# EAGLE design arduiniq_ver3 (EAGLE 7.2.0)
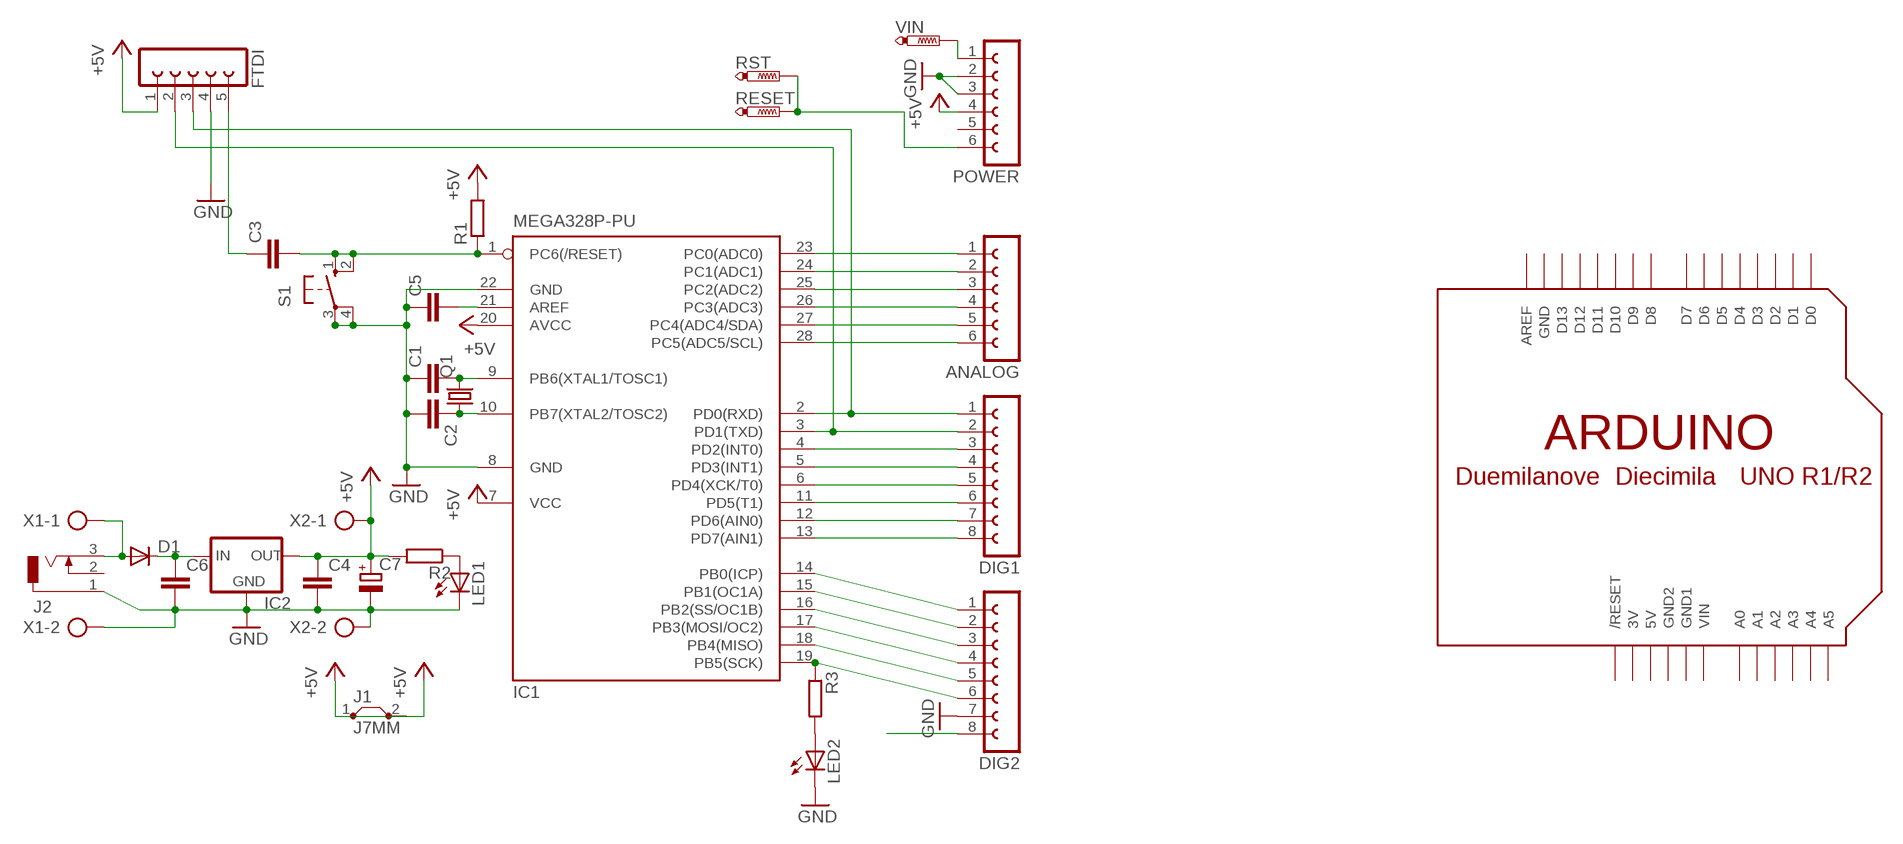
[diagram p0: schematic, sheet 1]

## Parts
ANALOG  FE06-1  [FE06]
C1  C-EU025-024X044  [C025-024X044]
C2  C-EU025-024X044  [C025-024X044]
C3  C-EU025-024X044  [C025-024X044]
C4  C-EU025-024X044  [C025-024X044]
C5  C-EU025-024X044  [C025-024X044]
C6  C-EU025-024X044  [C025-024X044]
C7  CPOL-EUE2.5-6  [E2,5-6]
D1  1N4004  [DO41-10]
DIG1  FE08-1  [FE08]
DIG2  FE08-1  [FE08]
FTDI  FE05-1  [FE05-1]
IC1  MEGA328P-PU  MEGA8-P  [DIL28-3]
IC2  78XXL  [78XXL]
J1  J7MM  [07]
J2  DCJ0303  [DCJ0303]
LED1  LED5MM  [LED5MM]
LED2  LED5MM  [LED5MM]
POWER  FE06-1  [FE06]
Q1  CRYSTALHC49S  [HC49/S]
R1  R-EU_0204/7  [0204/7]
R2  R-EU_0204/7  [0204/7]
R3  R-EU_0207/10  [0207/10]
RESET  PTR1PAD1-13Y  [P1-13Y]
RST  PTR1PAD1-13Y  [P1-13Y]
S1  10-XX  [B3F-10XX]
U$1  ARDUINO-BPLACE  [ARDUINO-BPLACE]
VIN  PTR1PAD1-13Y  [P1-13Y]
X1  AK500/2  [AK500/2]
X2  AK500/2  [AK500/2]

## Nets
+5V: C4.1 C7.+ FTDI.1 IC1.7(VCC) IC1.20(AVCC) IC2.OUT J1.1 J1.2 POWER.4 R1.2 R2.2 X2.1
AREF: C5.2 DIG2.8 IC1.21(AREF)
GND: C1.1 C2.2 C4.2 C5.1 C6.2 C7.- DIG2.7 FTDI.4 IC1.8(GND) IC1.22(GND) IC2.GND J2.1 LED1.K(C) LED2.K(C) POWER.2 POWER.3 S1.3(P) S1.4(P1) X1.2 X2.2
N$1: ANALOG.1 IC1.23(PC0(ADC0))
N$3: POWER.1 VIN.TP
N$4: ANALOG.3 IC1.25(PC2(ADC2))
N$5: ANALOG.2 IC1.24(PC1(ADC1))
N$6: ANALOG.5 IC1.27(PC4(ADC4/SDA))
N$8: ANALOG.6 IC1.28(PC5(ADC5/SCL))
N$9: ANALOG.4 IC1.26(PC3(ADC3))
N$10: C1.2 IC1.9(PB6(XTAL1/TOSC1)) Q1.2
N$11: C3.1 FTDI.5
N$12: DIG1.6 IC1.11(PD5(T1))
N$13: D1.A J2.3 X1.1
N$16: DIG2.2 IC1.15(PB1(OC1A))
N$17: DIG1.1 FTDI.3 IC1.2(PD0(RXD))
N$21: DIG1.2 FTDI.2 IC1.3(PD1(TXD))
N$22: DIG1.3 IC1.4(PD2(INT0))
N$23: DIG1.4 IC1.5(PD3(INT1))
N$24: DIG1.5 IC1.6(PD4(XCK/T0))
N$26: LED2.A R3.2
N$27: C6.1 D1.C IC2.IN
N$28: C2.1 IC1.10(PB7(XTAL2/TOSC2)) Q1.1
N$30: DIG1.7 IC1.12(PD6(AIN0))
N$31: DIG1.8 IC1.13(PD7(AIN1))
N$33: DIG2.1 IC1.14(PB0(ICP))
N$34: DIG2.3 IC1.16(PB2(SS/OC1B))
N$35: DIG2.4 IC1.17(PB3(MOSI/OC2))
N$36: DIG2.5 IC1.18(PB4(MISO))
N$37: DIG2.6 IC1.19(PB5(SCK)) R3.1
N$38: LED1.A R2.1
RESET: C3.2 IC1.1(PC6(/RESET)) POWER.6 R1.1 RESET.TP RST.TP S1.1(S) S1.2(S1)
Unconnected: J2.2 POWER.5 U$1.A0 U$1.A1 U$1.A2 U$1.A3 U$1.A4 U$1.A5 U$1.AREF U$1.D0 U$1.D1 U$1.D2 U$1.D3 U$1.D4 U$1.D5 U$1.D6 U$1.D7 U$1.D8 U$1.D9 U$1.D10 U$1.D11 U$1.D12 U$1.D13 U$1.RESET(/RESET)

## Power pins joined to a net without a drawn wire
3V: U$1.3V
+5V: U$1.5V
GND: U$1.GND
GND1: U$1.GND1
GND2: U$1.GND2
VIN: U$1.VIN

## Library data of the parts
ANALOG POWER = con-lsta:FE06-1: FEMALE HEADER; OC_FARNELL: unknown; OC_NEWARK: unknown
C1-C6 = rcl:C-EU: CAPACITOR, European symbol
C7 = rcl:CPOL-EU: POLARIZED CAPACITOR, European symbol
D1 = diode:1N4004: DIODE general purpose rectifier, 1 A
DIG1 DIG2 = con-lsta:FE08-1: FEMALE HEADER; OC_FARNELL: unknown; OC_NEWARK: unknown
FTDI = con-lsta:FE05-1: FEMALE HEADER; OC_FARNELL: unknown; OC_NEWARK: unknown
IC1 = atmel:MEGA8-P: MICROCONTROLLER 8 Kbytes FLASH, 1 kbytes SRAM, 512 bytes EEPROM, USART, 4-channel 10 bit ADC, 2-channel 8 bit ADC Pin compatible with Atmega48, ATMega88, ATMega168 Source: avr.lbr; OC_FARNELL: unknown; OC_NEWARK: unknown
IC2 = v-reg:78XXL: VOLTAGE REGULATOR
J1 = jumper:J: Bridge
J2 = con-jack:DCJ0303: DC POWER JACK Source: DCJ0303.pdf; OC_FARNELL: unknown; OC_NEWARK: unknown
LED1 LED2 = led:LED: LED OSRAM: - CHIPLED LG R971, LG N971, LY N971, LG Q971, LY Q971, LO R971, LY R971 LH N974, LH R974 LS Q976, LO Q976, LY Q976 LO Q996 - Hyper CHIPLED LW Q18S LB Q993, LB Q99A, LB R99A - SideLED LS A670, LO A670, LY A670, LG A670, LP A670 LB A673, LV A673, LT A673, LW A673 LH A674 LY A675 LS A676, LA A676, LO A676, LY A676, LW A676 LS A679, LY A679, LG A679 - Hyper Micro SIDELED® LS Y876, LA Y876, LO Y876, LY Y876 LT Y87S - SmartLED LW L88C, LW L88S LB L89C, LB L89S, LG L890 LS L89K, LO L89K, LY L89K LS L896, LA L896, LO L896, LY L896 - TOPLED LS T670, LO T670, LY T670, LG T670, LP T670 LSG T670, LSP T670, LSY T670, LOP T670, LYG T670 LG T671, LOG T671, LSG T671 LB T673, LV T673, LT T673, LW T673 LH T674 LS T676, LA T676, LO T676, LY T676, LB T676, LH T676, LSB T676, LW T676 LB T67C, LV T67C, LT T67C, LS T67K, LO T67K, LY T67K, LW E67C LS E67B, LA E67B, LO E67B, LY E67B, LB E67C, LV E67C, LT E67C LW T67C LS T679, LY T679, LG T679 LS T770, LO T770, LY T770, LG T770, LP T770 LB T773, LV T773, LT T773, LW T773 LH T774 LS E675, LA E675, LY E675, LS T675 LS T776, LA T776, LO T776, LY T776, LB T776 LHGB T686 LT T68C, LB T68C - Hyper Mini TOPLED® LB M676 - Mini TOPLED Santana® LG M470 LS M47K, LO M47K, LY M47K Source: http://www.osram.convergy.de LUXEON: - LUMILED® LXK2-PW12-R00, LXK2-PW12-S00, LXK2-PW14-U00, LXK2-PW14-V00 LXK2-PM12-R00, LXK2-PM12-S00, LXK2-PM14-U00 LXK2-PE12-Q00, LXK2-PE12-R00, LXK2-PE12-S00, LXK2-PE14-T00, LXK2-PE14-U00 LXK2-PB12-K00, LXK2-PB12-L00, LXK2-PB12-M00, LXK2-PB14-N00, LXK2-PB14-P00, LXK2-PB14-Q00 LXK2-PR12-L00, LXK2-PR12-M00, LXK2-PR14-Q00, LXK2-PR14-R00 LXK2-PD12-Q00, LXK2-PD12-R00, LXK2-PD12-S00 LXK2-PH12-R00, LXK2-PH12-S00 LXK2-PL12-P00, LXK2-PL12-Q00, LXK2-PL12-R00 Source: www.luxeon.com KINGBRIGHT: KA-3528ASYC Source: www.kingbright.com
Q1 = crystal:CRYSTAL: CRYSTAL; OC_FARNELL: 1667008; OC_NEWARK: unknown
R1-R3 = rcl:R-EU_: RESISTOR, European symbol
RESET RST VIN = testpad:PTR1: TEST PIN
S1 = switch-omron:10-XX: OMRON SWITCH; MPN: B3F-1000; OC_FARNELL: 176432; OC_NEWARK: 36M3542
U$1 = adafruit:ARDUINO: Arduino Diecimila/Duemilanove Make a shield with ease, this package has all the named pins as well as the two mounting drill holes and an outline of the USB and DC power connector. The outline is on the DIMENSION layer, so if your board house uses it they will cut the outline to match. http://www.ladyada.net/library/pcb/eaglelibrary.html
X1 X2 = con-ptr500:AK500/2: CONNECTOR; OC_FARNELL: unknown; OC_NEWARK: unknown

## Board
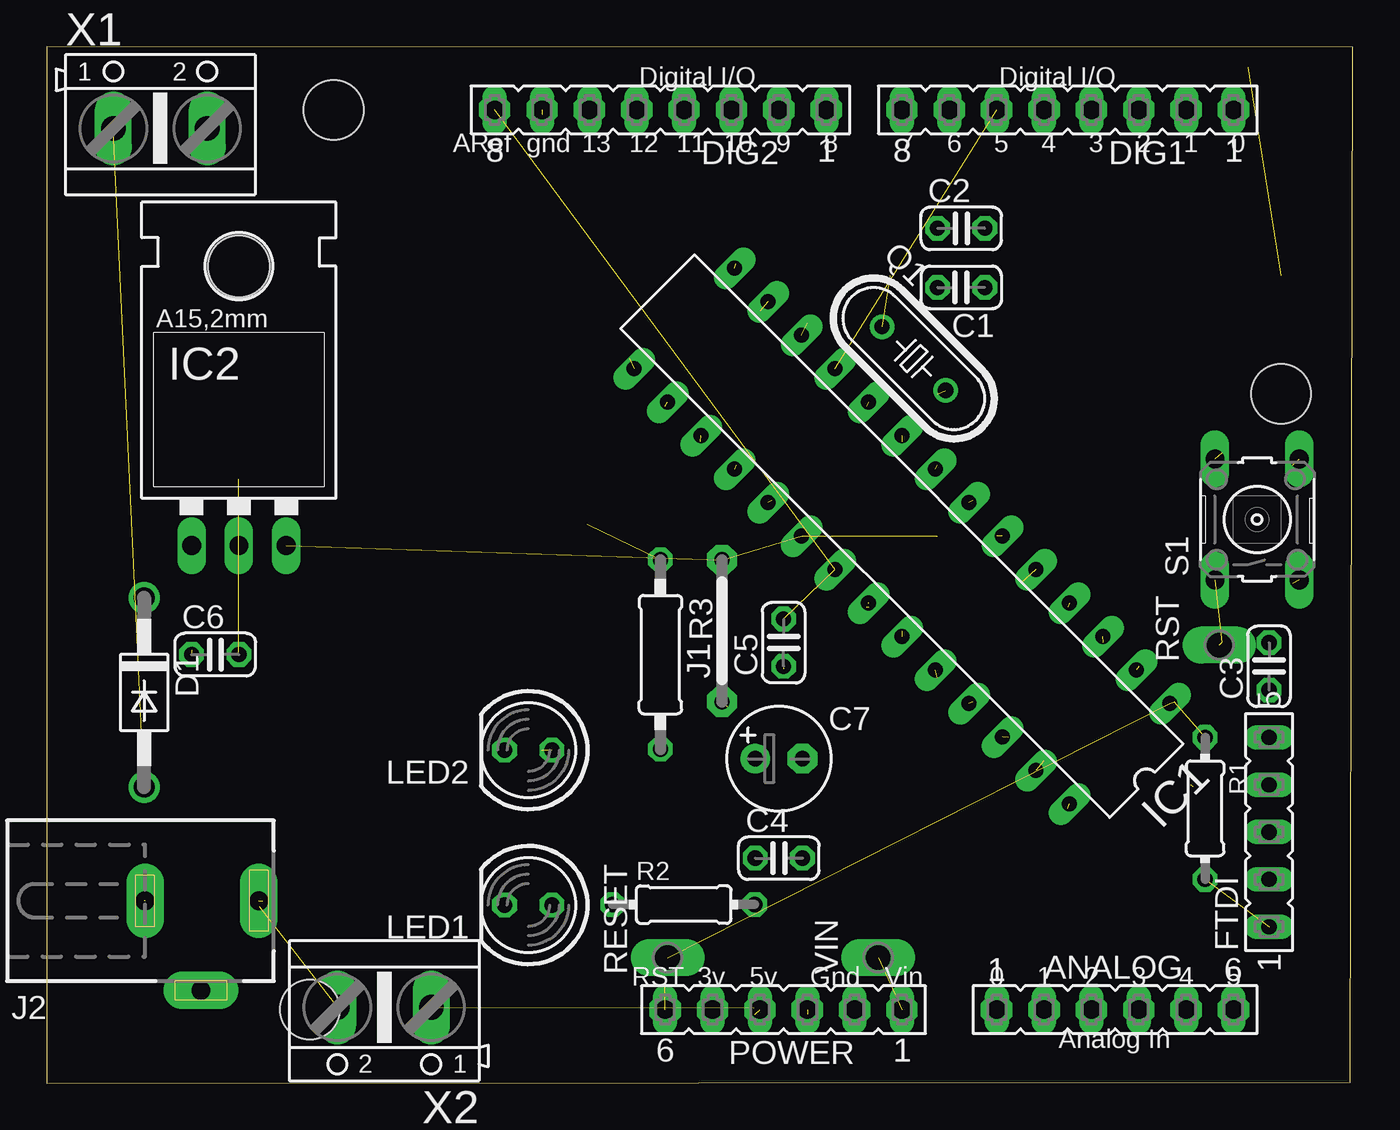
[diagram p1: board, top side]
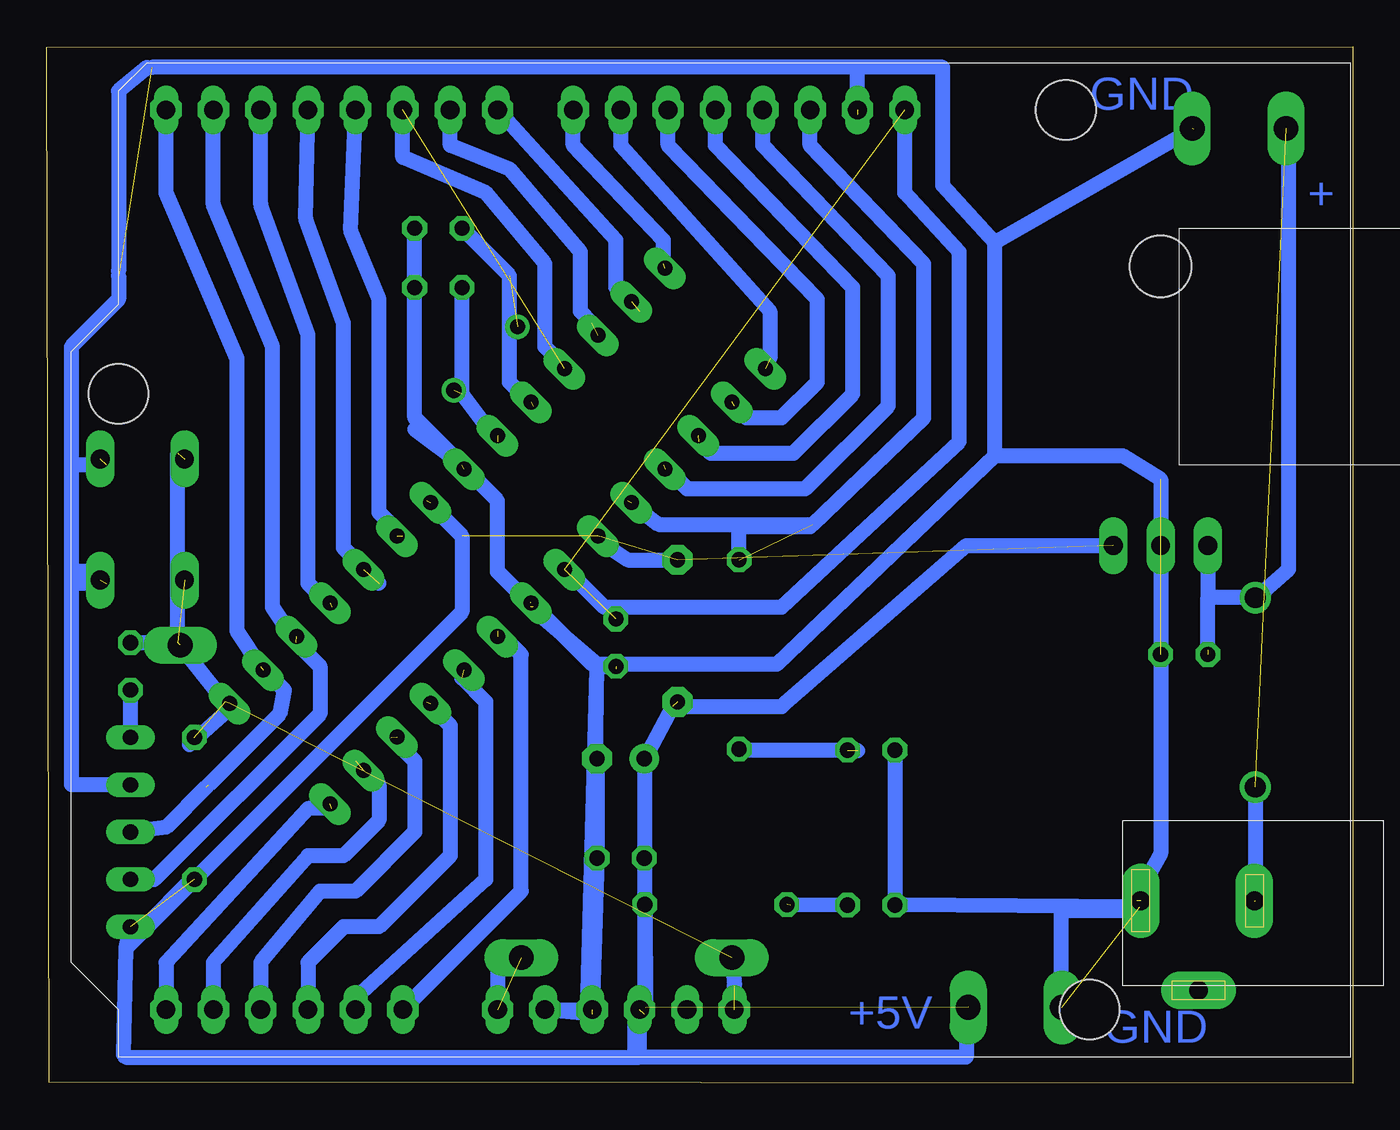
[diagram p2: board, bottom side, seen from below]

Size 70.05 x 55.59 mm. Coordinates in mm from the lower left corner, seen from the top.
Outline: 0,0 69.9,0.05 70.05,55.56 0,55.59 0,0
Copper layers (1*16): Top 0.035mm / dielectric 1.5mm / Bottom 0.035mm
Design rules "default": minimum track width 10mil, minimum drill 24mil, track to track 8mil, track to pad 8mil, pad to pad 8mil, via to via 8mil, smd to smd 8mil, copper to edge 40mil, drill to drill 8mil, minimum pad ring 10mil, minimum via ring 8mil, stop-mask expansion 4mil, vias tented up to drill 0mil, thermal gap 10mil

### Footprints (pad centres in the part's own frame; a part is rotated, then mirrored left to right if it is on the bottom)
FE06 = drill 0.813 long: 1 -6.35,0; 2 -3.81,0; 3 -1.27,0; 4 1.27,0; 5 3.81,0; 6 6.35,0
C025-024X044 = drill 0.813 octagon: 1 -1.27,0; 2 1.27,0
E2,5-6 = drill 0.813 pad 1.6: + -1.27,0 | drill 0.813 pad 1.6 octagon: - 1.27,0
DO41-10 = drill 1.118: A 5.08,0; C -5.08,0
FE08 = drill 0.813 long: 1 -8.89,0; 2 -6.35,0; 3 -3.81,0; 4 -1.27,0; 5 1.27,0; 6 3.81,0; 7 6.35,0; 8 8.89,0
FE05-1 = drill 0.813 long: 1 -5.08,0; 2 -2.54,0; 3 0,0; 4 2.54,0; 5 5.08,0
DIL28-3 = drill 0.813 long: 1 -16.51,-3.81; 2 -13.97,-3.81; 3 -11.43,-3.81; 4 -8.89,-3.81; 5 -6.35,-3.81; 6 -3.81,-3.81; 7 -1.27,-3.81; 8 1.27,-3.81; 9 3.81,-3.81; 10 6.35,-3.81; 11 8.89,-3.81; 12 11.43,-3.81; 13 13.97,-3.81; 14 16.51,-3.81; 15 16.51,3.81; 16 13.97,3.81; 17 11.43,3.81; 18 8.89,3.81; 19 6.35,3.81; 20 3.81,3.81; 21 1.27,3.81; 22 -1.27,3.81; 23 -3.81,3.81; 24 -6.35,3.81; 25 -8.89,3.81; 26 -11.43,3.81; 27 -13.97,3.81; 28 -16.51,3.81
78XXL = drill 1.016 long: GND 0,-3.81; IN -2.54,-3.81; OUT 2.54,-3.81 | hole 3.302: 0,11.176
07 = drill 0.813 pad 1.6 octagon: 1 -3.81,0; 2 3.81,0
DCJ0303 = drill 1 pad 2 long: 1 0,3.1; 2 4.8,0; 3 0,-3
LED5MM = drill 0.813 octagon: A -1.27,0; K 1.27,0
HC49/S = drill 0.813: 1 -2.413,0; 2 2.413,0
0204/7 = drill 0.813 octagon: 1 -3.81,0; 2 3.81,0
0207/10 = drill 0.813 octagon: 1 -5.08,0; 2 5.08,0
P1-13Y = drill 1.321 pad 1.905 long: TP 0,0
B3F-10XX = drill 1.016 long: 1 -3.251,2.261; 2 3.251,2.261; 3 -3.251,-2.261; 4 3.251,-2.261
ARDUINO-BPLACE = drill 1 pad 1.676 octagon: 3V 35.56,2.54; 5V 38.1,2.54; A0 50.8,2.54; A1 53.34,2.54; A2 55.88,2.54; A3 58.42,2.54; A4 60.96,2.54; A5 63.5,2.54; AREF 23.876,50.8; D0 63.5,50.8; D1 60.96,50.8; D2 58.42,50.8; D3 55.88,50.8; D4 53.34,50.8; D5 50.8,50.8; D6 48.26,50.8; D7 45.72,50.8; D8 41.656,50.8; D9 39.116,50.8; D10 36.576,50.8; D11 34.036,50.8; D12 31.496,50.8; D13 28.956,50.8; GND 26.416,50.8; GND1 43.18,2.54; GND2 40.64,2.54; RESET 33.02,2.54; VIN 45.72,2.54 | hole 3.2: 15.24,50.8; 66.04,35.56; 13.97,2.54
AK500/2 = drill 1.321 long: 1 -2.515,0; 2 2.515,0

### Placement (x,y rotation side)
ANALOG  57.3,3.94 0 top
C1  49.05,42.67 180 top
C2  49.05,45.85 0 top
C3  65.56,22.35 90 top
C4  39.27,12.06 0 top
C5  39.52,23.62 90 top
C6  9.04,22.99 0 top
C7  39.27,17.4 0 top
D1  5.23,20.96 270 top
DIG1  54.76,52.2 180 top
DIG2  32.92,52.2 180 top
FTDI  65.56,13.46 90 top
IC1  45.87,29.34 135 top
IC2  10.31,32.64 0 top
J1  36.22,24.26 90 top
J2  8.28,9.78 270 top
LED1  25.83,9.55 180 top
LED2  25.83,17.86 180 top
POWER  39.52,3.94 180 top
Q1  46.51,38.86 315 top
R1  62.13,14.73 270 top
R2  34.16,9.58 0 top
R3  32.92,22.99 270 top
RESET  33.3,6.73 90 top
RST  62.89,23.5 90 top
S1  64.92,30.23 90 top
U$1  0.15,1.4 0 top
VIN  44.6,6.73 90 top
X1  6.1,51.21 0 top
X2  18.11,4.06 180 top

### Tracks (layer width: path | path; a pad name or v marks a point on that pad's centre or on a via)
+5V  (8 unrouted)
  Bottom 0.813: 49.68,31.24 47.78,29.34 47.78,25.27 65.81,7.24 | 65.81,7.24 65.94,1.52 65.81,1.4 38.25,1.4 POWER.4 37.95,4.04 R2.2 | FTDI.1 65.81,7.24 | 38,17.65 C7.+ | C7.+ C4.1 38,3.68 | 36.47,20.19 C7.+
AREF  (2 unrouted)
GND  (14 unrouted)
  Bottom 0.813: C2.2 C1.1 50.32,35.69 47.78,33.15 | 47.78,33.15 50.32,35.05 | 43.97,25.53 45.87,27.43 45.87,31.24 47.78,33.15 | 66.19,43.31 66.19,42.04 68.73,39.5 68.73,33.15 | 68.73,33.15 68.73,27.43 | 68.73,27.43 68.73,26.8 | 68.73,26.8 68.73,16 FTDI.4 | 67.46,27.43 68.73,27.43 | 66.83,26.8 68.73,26.8 | 66.83,33.15 68.73,33.15 | 40.28,17.4 C7.- C4.2 40.79,3.68 POWER.2 | 43.59,3.94 POWER.2 | POWER.2 41.05,3.94 40.54,22.22 40.54,22.48 | 44.09,25.78 40.79,22.48 40.54,22.48 | 40.54,22.48 30.89,22.48 19.2,33.66 | 19.2,33.66 19.2,45.08 | 19.2,45.08 22,48.13 22,54.48 26.57,54.48 | 26.57,51.94 26.57,54.48 | 26.57,54.48 64.41,54.48 | 40.79,4.19 40.54,22.48 | 40.54,22.48 44.09,25.53 | 40.54,22.48 39.52,22.22 | 19.2,33.66 12.34,33.66 10.31,32.39 10.31,12.32 11.58,10.03 11.58,9.78 11.43,9.45 LED1.K LED2.K | 8.53,51.18 19.2,45.08
N$1  (1 unrouted)
  Bottom 0.813: ANALOG.1 44.6,10.29 44.6,22.99 45.87,24.26
N$2
  Bottom 0.813: 40.79,29.34 38.89,28.07 36.22,28.07
N$3  (1 unrouted)
N$4  (1 unrouted)
  Bottom 0.813: 49.68,20.45 48.41,19.18 48.41,12.19 52.22,8.38 54.13,8.38 56.03,6.48 ANALOG.3
N$5  (1 unrouted)
  Bottom 0.813: 47.78,21.72 46.51,20.45 46.51,10.92 53.49,4.57 ANALOG.2
N$6  (1 unrouted)
  Bottom 0.813: 53.49,17.27 52.22,16 52.22,14.1 54.13,12.19 56.03,12.19 61.11,6.48 ANALOG.5
N$7
  Bottom 0.813: 44.86,6.73 45.87,6.73 45.87,3.68
N$8  (1 unrouted)
  Bottom 0.813: 54.76,14.73 56.03,14.73 63.65,6.48 ANALOG.6
N$9  (1 unrouted)
  Bottom 0.813: 51.59,18.54 50.32,17.27 50.32,13.46 53.49,10.29 55.4,10.29 58.57,6.48 ANALOG.4
N$10  (2 unrouted)
  Bottom 0.813: 45.87,34.42 47.78,36.96 C1.2
N$11
  Bottom 0.813: C3.1 FTDI.5
N$12  (1 unrouted)
N$13  (2 unrouted)
  Bottom 0.813: D1.A 5.23,9.78
N$14
  Bottom 0.813: 39.52,24.76 39.52,25.27 40.03,25.53 | 42.06,27.43 40.16,25.53 40.03,25.53 | 40.03,25.53 30.63,25.53 21.11,34.42 21.11,44.58 24.03,47.75 24.03,52.83
N$15
  Bottom 0.813: 64.67,54.48 66.19,53.21 66.19,43.56
N$16  (1 unrouted)
  Bottom 0.813: DIG2.2 39.27,50.29 31.27,41.4 31.27,38.86
N$17  (2 unrouted)
  Bottom 0.813: 61.49,15.88 63.65,13.72 FTDI.3 | DIG1.1 63.65,47.75 59.84,38.86 59.84,24.26 58.57,22.35 57.3,21.08 57.56,19.81 61.37,16
N$18
  Bottom 0.813: 62.38,18.16 60.1,20.19
N$19
  Bottom 0.813: 62.13,11.05 64.92,8.25 65.68,8.25
N$20
  Bottom 0.813: 3.45,50.93 3.45,27.56 5.49,25.78
N$21  (1 unrouted)
  Bottom 0.813: DIG1.2 61.11,47.12 57.94,39.5 57.94,25.53 56.67,23.62 55.4,22.35 55.4,19.81 64.29,10.92 FTDI.2
N$22  (1 unrouted)
  Bottom 0.813: 54.76,25.53 56.03,26.8 56.03,40.13 58.57,47.12 DIG1.3
N$23  (1 unrouted)
  Bottom 0.813: 52.22,26.8 54.13,28.7 54.13,40.77 56.16,46.36 DIG1.4
N$24  (1 unrouted)
  Bottom 0.813: 50.95,29.34 52.22,30.61 52.22,42.04 53.75,45.72 DIG1.5
N$25
  Bottom 0.813: 32.92,28.07 32.92,29.85 29.11,29.85
N$26  (1 unrouted)
  Bottom 0.813: 26.54,17.83 33.1,17.83 32.72,17.73 R3.2
N$27  (1 unrouted)
  Bottom 0.813: IC2.IN 7.77,26.04 | 7.77,23.24 7.77,26.04 | 4.98,26.04 D1.C | 5.23,25.78 D1.C | D1.C 7.77,26.04
N$28  (2 unrouted)
  Bottom 0.813: 43.97,36.32 45.24,37.59 45.24,43.31 C2.1
N$29
  Bottom 0.813: 42.06,38.23 43.33,39.5 43.33,43.94 46.51,47.75 50.95,49.66 50.95,52.83
N$30  (1 unrouted)
  Bottom 0.813: 40.79,40.77 41.43,41.4 41.43,44.58 45.24,49.02 48.41,50.29 DIG1.7
N$31  (1 unrouted)
  Bottom 0.813: 38.25,41.4 39.52,42.67 39.52,45.21 DIG1.8
N$32
  Bottom 0.813: 35.97,20.19 30.63,20.19 20.73,28.83 12.6,28.83
N$33  (1 unrouted)
  Bottom 0.813: 36.98,43.94 36.98,45.21 41.81,50.29 DIG2.1
N$34  (1 unrouted)
  Bottom 0.813: 33.17,36.32 32.54,35.69 30.63,35.69 28.73,37.59 28.73,42.04 36.73,50.29 DIG2.3
N$35  (1 unrouted)
  Bottom 0.813: 35.08,34.42 34.44,33.78 30,33.78 26.82,36.96 26.82,42.67 34.19,50.29 DIG2.4
N$36  (1 unrouted)
  Bottom 0.813: 36.98,33.15 35.71,31.88 29.36,31.88 24.92,36.32 24.92,43.31 31.65,50.29 DIG2.5
N$37  (2 unrouted)
  Bottom 0.813: 38.89,31.24 37.24,29.97 28.98,29.97 23.01,35.69 23.01,43.94 29.11,50.29 DIG2.6
N$38  (1 unrouted)
  Bottom 0.813: LED1.A 30.15,9.52
N$39
  Bottom 0.813: 20.73,4.19 20.73,1.4 38.51,1.4 38.51,3.68
N$40
  Bottom 0.813: 15.65,4.19 15.65,9.27 11.33,9.27 11.33,9.78
RESET  (7 unrouted)
  Bottom 0.813: 60.48,20.45 63.02,23.62 | C3.2 63.02,23.62 | 63.02,23.62 63.02,33.78 | RESET.TP 33.17,5.21

### Text on the board
Bottom: GND | + | +5V | GND